# EAGLE design ULN2003_SixStrip_v01 (EAGLE 5.09)
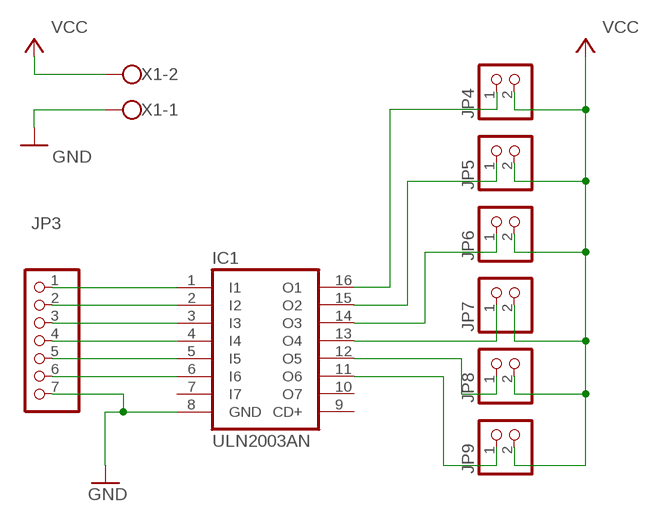
[diagram p0: schematic, sheet 1]

## Parts
IC1  ULN2003AN  [DIL16]
JP3  PINHD-1X7  [1X07]
JP4  PINHD-1X2  [1X02]
JP5  PINHD-1X2  [1X02]
JP6  PINHD-1X2  [1X02]
JP7  PINHD-1X2  [1X02]
JP8  PINHD-1X2  [1X02]
JP9  PINHD-1X2  [1X02]
X1  W237-102  [W237-102]

## Nets
GND: IC1.8(GND) JP3.7 X1.1
N$1: IC1.16(O1) JP4.1
N$2: IC1.1(I1) JP3.1
N$3: IC1.2(I2) JP3.2
N$4: IC1.3(I3) JP3.3
N$5: IC1.4(I4) JP3.4
N$6: IC1.5(I5) JP3.5
N$7: IC1.6(I6) JP3.6
N$8: IC1.15(O2) JP5.1
N$9: IC1.14(O3) JP6.1
N$10: IC1.13(O4) JP7.1
N$11: IC1.12(O5) JP8.1
N$12: IC1.11(O6) JP9.1
VCC: JP4.2 JP5.2 JP6.2 JP7.2 JP8.2 JP9.2 X1.2
Unconnected: IC1.7(I7) IC1.9(CD+) IC1.10(O7)

## Library data of the parts
IC1 = uln-udn:ULN2003A: DRIVER ARRAY
JP3 = pinhead:PINHD-1X7: PIN HEADER
JP4-JP9 = pinhead:PINHD-1X2: PIN HEADER
X1 = con-wago-500:W237-102: WAGO SCREW CLAMP

## Board
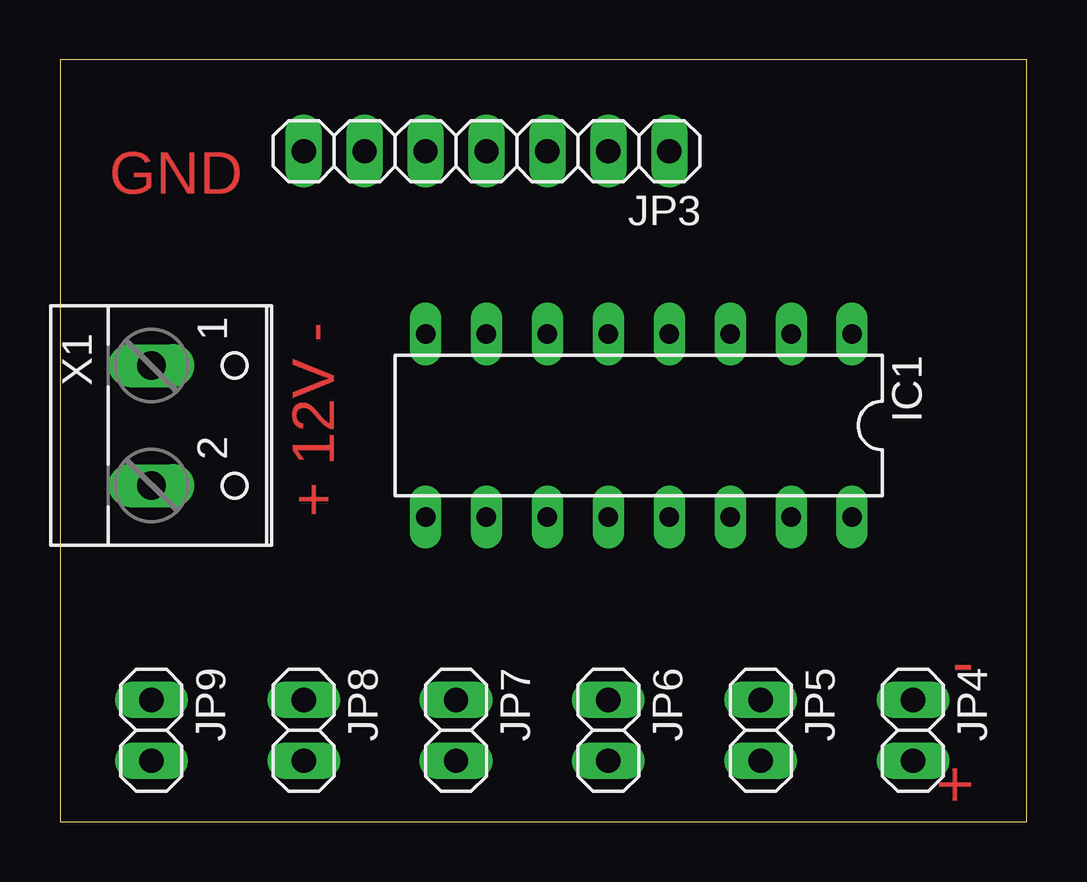
[diagram p1: board, top side]
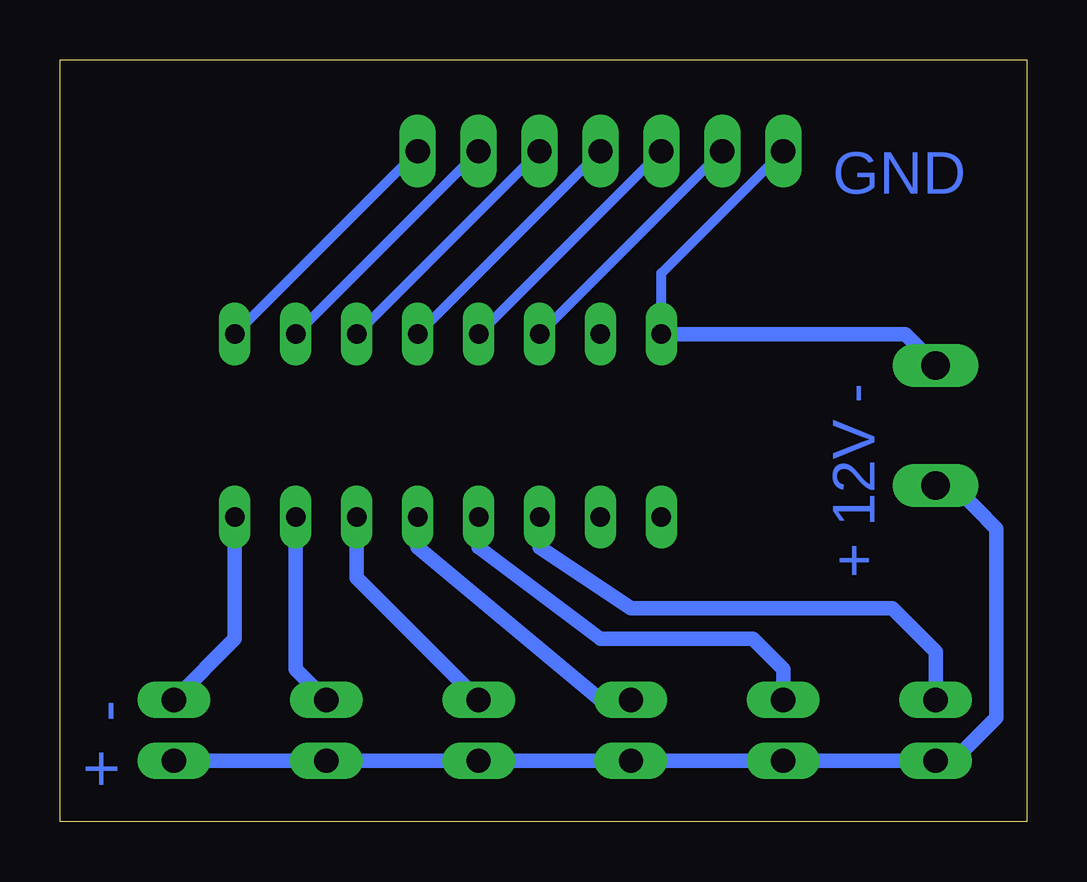
[diagram p2: board, bottom side, seen from below]

Size 40.31 x 31.74 mm. Coordinates in mm from the lower left corner, seen from the top.
Outline: 0,0 40.31,0 40.31,31.74 0,31.74 0,0
Copper layers (1*16): Top 0.035mm / dielectric 1.5mm / Bottom 0.035mm
Design rules "default": minimum track width 10mil, minimum drill 24mil, track to track 8mil, track to pad 8mil, pad to pad 8mil, via to via 8mil, smd to smd 8mil, copper to edge 40mil, drill to drill 8mil, minimum pad ring 10mil, minimum via ring 8mil, stop-mask expansion 4mil, vias tented up to drill 0mil, thermal gap 10mil

### Footprints (pad centres in the part's own frame; a part is rotated, then mirrored left to right if it is on the bottom)
DIL16 = drill 0.813 long: 1 -8.89,-3.81; 2 -6.35,-3.81; 3 -3.81,-3.81; 4 -1.27,-3.81; 5 1.27,-3.81; 6 3.81,-3.81; 7 6.35,-3.81; 8 8.89,-3.81; 9 8.89,3.81; 10 6.35,3.81; 11 3.81,3.81; 12 1.27,3.81; 13 -1.27,3.81; 14 -3.81,3.81; 15 -6.35,3.81; 16 -8.89,3.81
1X07 = drill 1.016 long: 1 -7.62,0; 2 -5.08,0; 3 -2.54,0; 4 0,0; 5 2.54,0; 6 5.08,0; 7 7.62,0
1X02 = drill 1.016 long: 1 -1.27,0; 2 1.27,0
W237-102 = drill 1.194 long: 1 -2.5,-1.27; 2 2.5,-1.27

### Placement (x,y rotation side)
IC1  24.13,16.51 180 top
JP3  17.78,27.94 180 top
JP4  35.56,3.81 270 top
JP5  29.21,3.81 270 top
JP6  22.86,3.81 270 top
JP7  16.51,3.81 270 top
JP8  10.16,3.81 270 top
JP9  3.81,3.81 270 top
X1  5.08,16.51 270 top

### Tracks (layer width: path | path; a pad name or v marks a point on that pad's centre or on a via)
GND
  Bottom 0.254: X1.1 3.81,19.05
  Bottom 0.406: IC1.8 15.24,22.86 JP3.7
  Bottom 0.61: 3.81,19.05 5.08,20.32 IC1.8
N$1
  Bottom 0.61: IC1.16 33.02,7.62 JP4.1
N$2
  Bottom 0.406: IC1.1 JP3.1
N$3
  Bottom 0.406: IC1.2 JP3.2
N$4
  Bottom 0.406: IC1.3 JP3.3
N$5
  Bottom 0.406: IC1.4 JP3.4
N$6
  Bottom 0.406: IC1.5 JP3.5
N$7
  Bottom 0.406: IC1.6 JP3.6
N$8
  Bottom 0.61: IC1.15 30.48,6.35 JP5.1
N$9
  Bottom 0.61: IC1.14 27.94,10.16 JP6.1
N$10
  Bottom 0.254: JP7.1 17.78,5.08
  Bottom 0.61: 17.78,5.08 25.4,11.43 IC1.13
N$11
  Bottom 0.61: IC1.12 22.86,11.43 17.78,7.62 11.43,7.62 10.16,6.35 JP8.1
N$12
  Bottom 0.61: IC1.11 20.32,11.43 16.51,8.89 5.61,8.89 3.81,7.09 JP9.1
VCC
  Bottom 0.61: JP4.2 JP5.2 JP6.2 JP7.2 JP8.2 JP9.2 3.07,2.54 1.27,4.34 1.27,12.2 3.04,14 X1.2

### Text on the board
Top: GND | + 12V - | - | +
Bottom: GND | + 12V - | - | +